# Altium schematic sheet Real_Steel_Robotics.SchDoc
size 420 x 297 mm; SheetNumber: 1; SheetTotal: 1
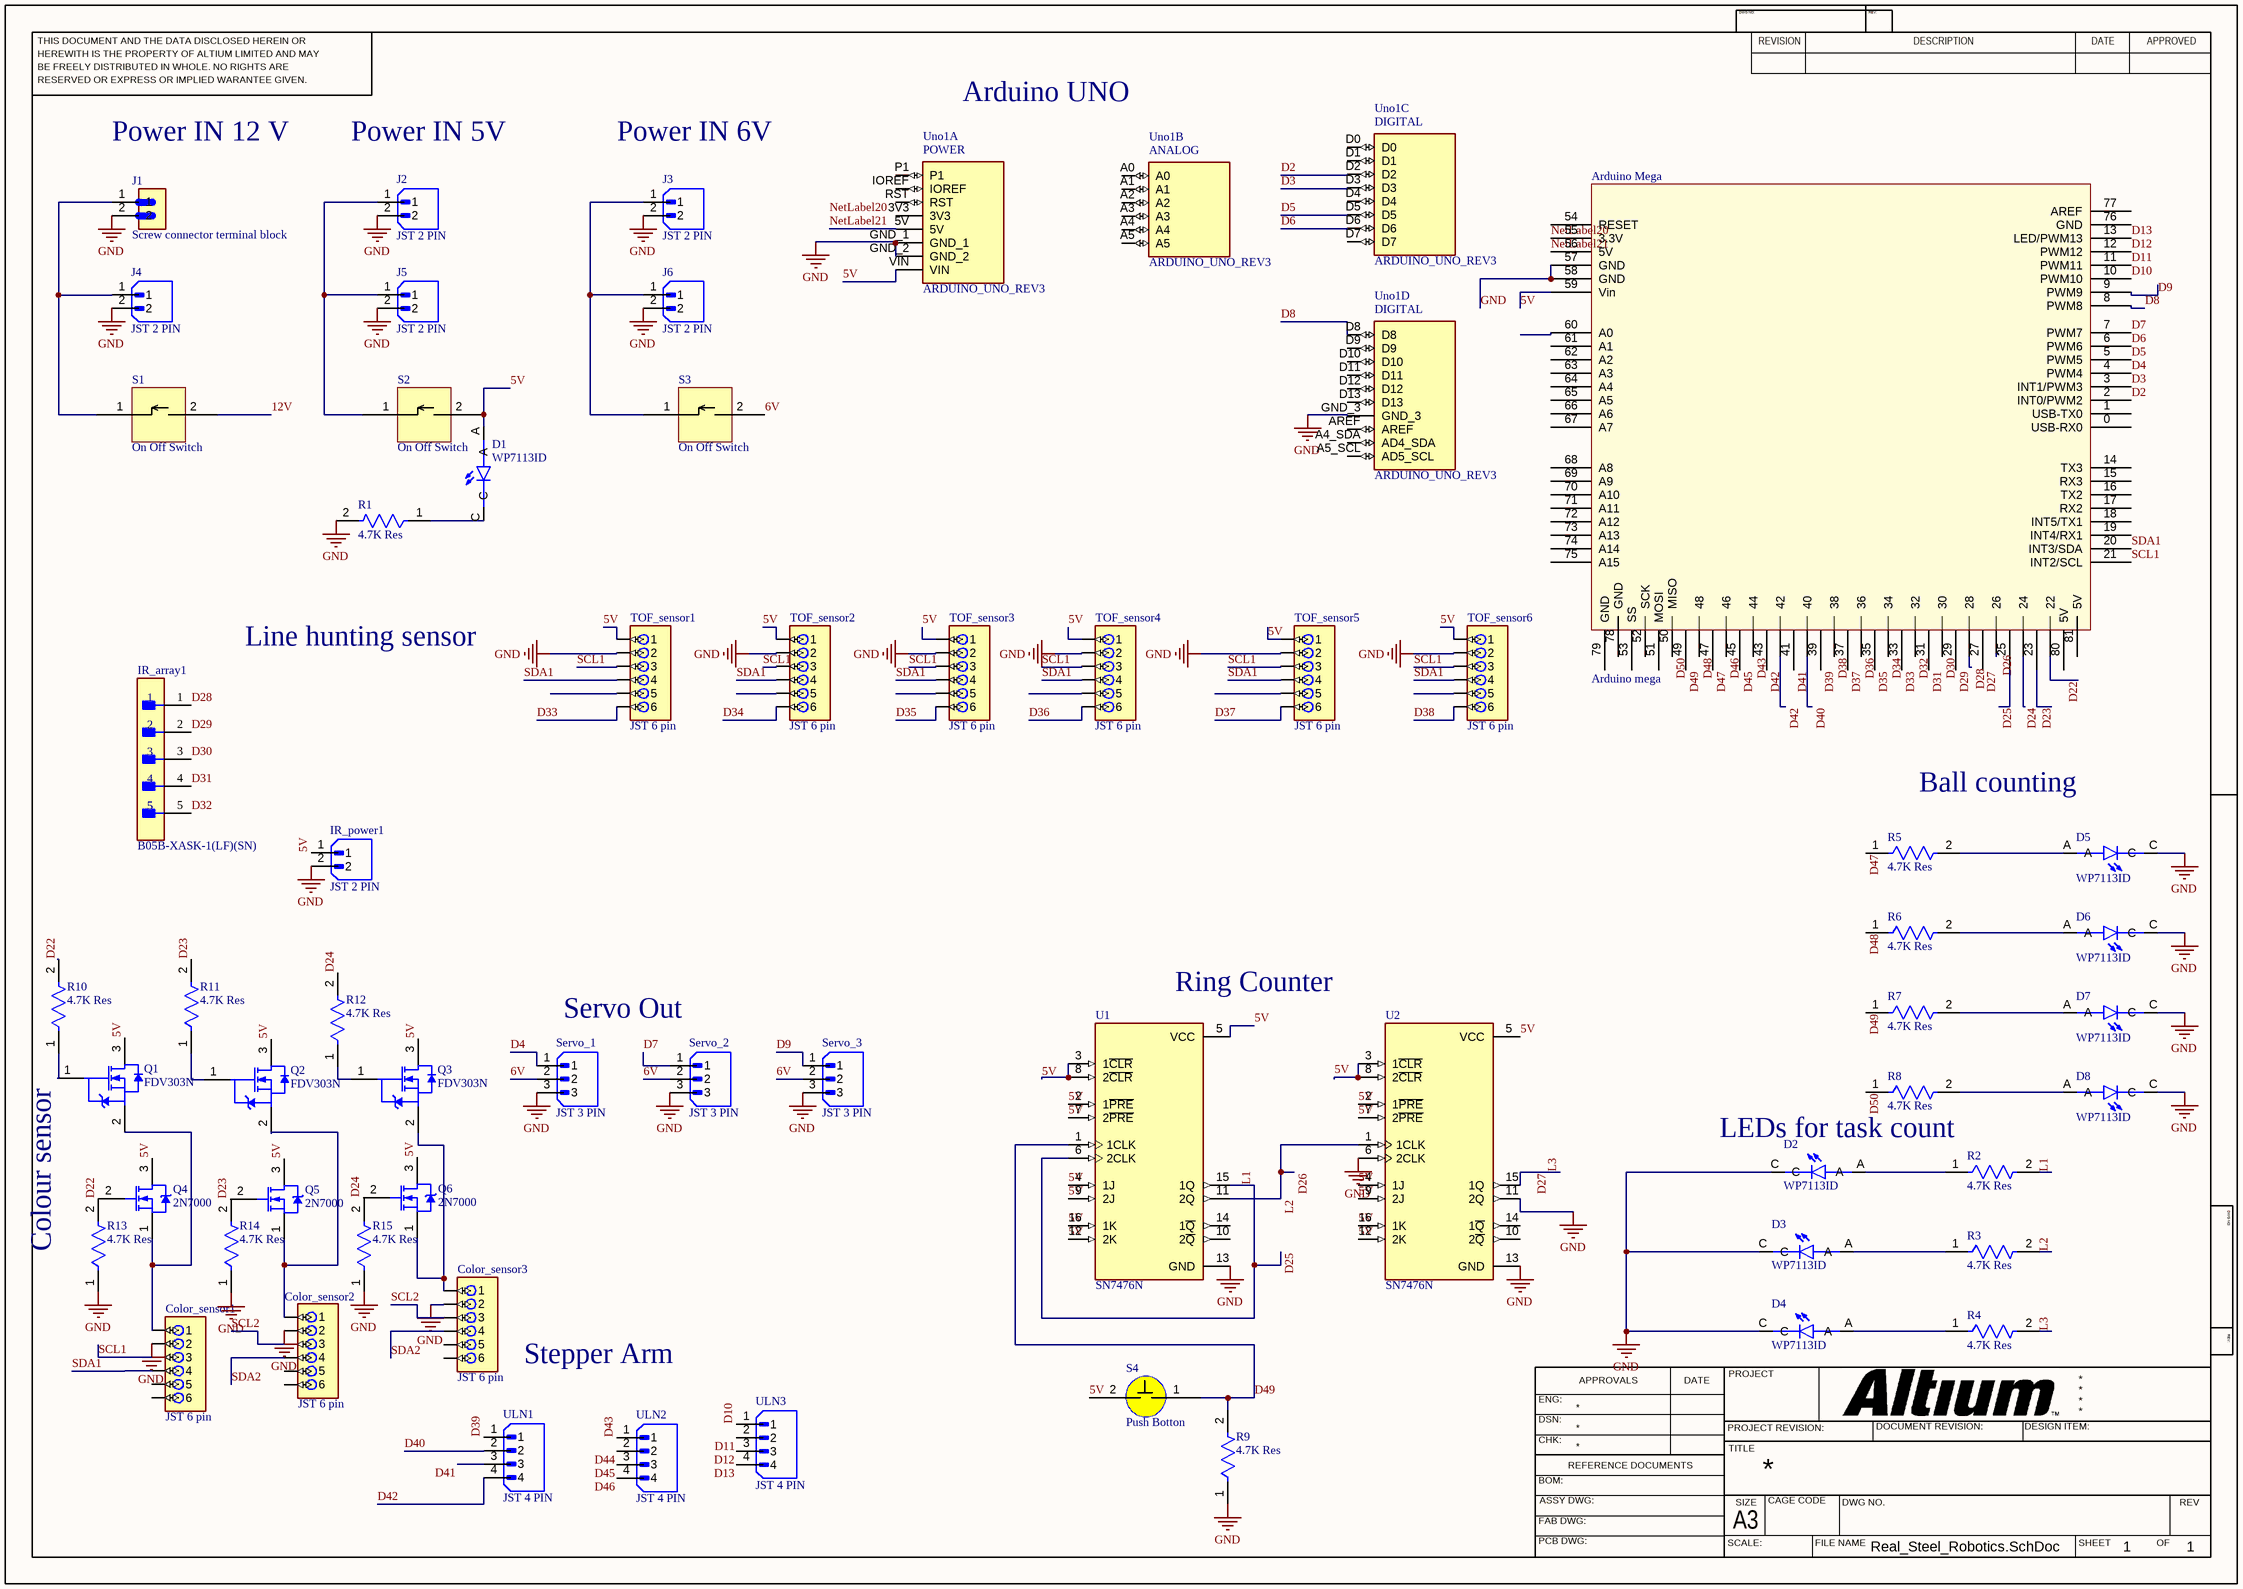
[diagram p0: Real_Steel_Robotics.SchDoc]

## Parts
Arduino_Mega  Arduino mega  [Arduino mega]
Color_sensor1  JST 6 pin  [JST 6 PIN]
Color_sensor2  JST 6 pin  [JST 6 PIN]
Color_sensor3  JST 6 pin  [JST 6 PIN]
D1  WP7113ID  [LED_WP7113ID]
D2  WP7113ID  [LED_WP7113ID]
D3  WP7113ID  [LED_WP7113ID]
D4  WP7113ID  [LED_WP7113ID]
D5  WP7113ID  [LED_WP7113ID]
D6  WP7113ID  [LED_WP7113ID]
D7  WP7113ID  [LED_WP7113ID]
D8  WP7113ID  [LED_WP7113ID]
IR_array1  B05B-XASK-1(LF)(SN)  [JST 5 PIN]
IR_power1  JST 2 PIN  [JST 2 PIN]
J1  Screw connector terminal block  [Screw Connector]
J2  JST 2 PIN  [JST 2 PIN]
J3  JST 2 PIN  [JST 2 PIN]
J4  JST 2 PIN  [JST 2 PIN]
J5  JST 2 PIN  [JST 2 PIN]
J6  JST 2 PIN  [JST 2 PIN]
Q1  FDV303N  [FAIR-FDV303N-3_V]
Q2  FDV303N  [FAIR-FDV303N-3_V]
Q3  FDV303N  [FAIR-FDV303N-3_V]
Q4  2N7000  [ONSC-TO-92-3-29-11]
Q5  2N7000  [ONSC-TO-92-3-29-11]
Q6  2N7000  [ONSC-TO-92-3-29-11]
R1  4.7K Res  [4.7K res]
R2  4.7K Res  [4.7K res]
R3  4.7K Res  [4.7K res]
R4  4.7K Res  [4.7K res]
R5  4.7K Res  [4.7K res]
R6  4.7K Res  [4.7K res]
R7  4.7K Res  [4.7K res]
R8  4.7K Res  [4.7K res]
R9  4.7K Res  [4.7K res]
R10  4.7K Res  [4.7K res]
R11  4.7K Res  [4.7K res]
R12  4.7K Res  [4.7K res]
R13  4.7K Res  [4.7K res]
R14  4.7K Res  [4.7K res]
R15  4.7K Res  [4.7K res]
S1  On Off Switch  [Switch]
S2  On Off Switch  [Switch]
S3  On Off Switch  [Switch]
S4  Push Botton  [Push botton]
Servo_1  JST 3 PIN  [JST 3 PIN]
Servo_2  JST 3 PIN  [JST 3 PIN]
Servo_3  JST 3 PIN  [JST 3 PIN]
TOF_sensor1  JST 6 pin  [JST 6 PIN]
TOF_sensor2  JST 6 pin  [JST 6 PIN]
TOF_sensor3  JST 6 pin  [JST 6 PIN]
TOF_sensor4  JST 6 pin  [JST 6 PIN]
TOF_sensor5  JST 6 pin  [JST 6 PIN]
TOF_sensor6  JST 6 pin  [JST 6 PIN]
U1  SN7476N  [SN7476 IC]
U2  SN7476N  [SN7476 IC]
ULN1  JST 4 PIN  [JST 4 PIN]
ULN2  JST 4 PIN  [JST 4 PIN]
ULN3  JST 4 PIN  [JST 4 PIN]
Uno1  ARDUINO_UNO_REV3  [ARDUINO_ARDUINO_UNO_REV3]  (parts A,B,C,D of 4)

## Nets
GND: Arduino_Mega.57(GND) Arduino_Mega.58(GND) Color_sensor1.2 Color_sensor2.2 Color_sensor3.2 D2.C D3.C D4.C D5.C D6.C D7.C D8.C IR_power1.2 J1.2 J2.2 J3.2 J4.2 J5.2 J6.2 R1.2 R9.1 R14.1 Servo_1.3 Servo_2.3 Servo_3.3 TOF_sensor1.2 TOF_sensor2.2 TOF_sensor3.2 TOF_sensor4.2 TOF_sensor5.2 TOF_sensor6.2 U1.13(GND) U2.6(2CLK) U2.11(2Q) U2.13(GND) Uno1.GND_1 Uno1.GND_2 Uno1.GND_3
5V: Arduino_Mega.59(Vin) D1.A IR_power1.1 Q1.3(D) Q2.3(D) Q3.3(D) Q4.3(D) Q5.3(D) Q6.3(D) S2.2 S4.2(P29) TOF_sensor1.1 TOF_sensor2.1 TOF_sensor3.1 TOF_sensor4.1 TOF_sensor5.1 TOF_sensor6.1 U1.2(1~{PRE}) U1.3(1~{CLR}) U1.4(1J) U1.5(VCC) U1.7(2~{PRE}) U1.8(2~{CLR}) U1.9(2J) U1.12(2K) U1.16(1K) U2.2(1~{PRE}) U2.3(1~{CLR}) U2.4(1J) U2.5(VCC) U2.7(2~{PRE}) U2.8(2~{CLR}) U2.9(2J) U2.12(2K) U2.16(1K) Uno1.VIN
6V: S3.2 Servo_1.2 Servo_2.2 Servo_3.2
12V: S1.2
D2: Arduino_Mega.2(INT0/PWM2) Uno1.D2
D3: Arduino_Mega.3(INT1/PWM3) Uno1.D3
D4: Arduino_Mega.4(PWM4) Servo_1.1
D5: Arduino_Mega.5(PWM5) Uno1.D5
D6: Arduino_Mega.6(PWM6) Uno1.D6
D7: Arduino_Mega.7(PWM7) Servo_2.1
D8: Arduino_Mega.8(PWM8) Uno1.D8
D9: Arduino_Mega.9(PWM9) Servo_3.1
D10: Arduino_Mega.10(PWM10) ULN3.1
D11: Arduino_Mega.11(PWM11) ULN3.2
D12: Arduino_Mega.12(PWM12) ULN3.3
D13: Arduino_Mega.13(LED/PWM13) ULN3.4
D22: Arduino_Mega.22 Q4.2(G) R10.2 R13.2
D23: Arduino_Mega.23 Q5.2(G) R11.2
D24: Arduino_Mega.24 Q6.2(G) R12.2
D25: Arduino_Mega.25 R2.2 U1.6(2CLK) U1.15(1Q)  [also labelled L1]
D26: Arduino_Mega.26 R3.2 U1.11(2Q) U2.1(1CLK)  [also labelled L2]
D27: Arduino_Mega.27 R4.2 U2.15(1Q)  [also labelled L3]
D28: Arduino_Mega.28 IR_array1.1
D29: Arduino_Mega.29 IR_array1.2
D30: Arduino_Mega.30 IR_array1.3
D31: Arduino_Mega.31 IR_array1.4
D32: Arduino_Mega.32 IR_array1.5
D33: Arduino_Mega.33 TOF_sensor1.6
D34: Arduino_Mega.34 TOF_sensor2.6
D35: Arduino_Mega.35 TOF_sensor3.6
D36: Arduino_Mega.36 TOF_sensor4.6
D37: Arduino_Mega.37 TOF_sensor5.6
D38: Arduino_Mega.38 TOF_sensor6.6
D39: Arduino_Mega.39 ULN1.1
D40: Arduino_Mega.40 ULN1.2
D41: Arduino_Mega.41 ULN1.3
D42: Arduino_Mega.42 Arduino_Mega.43 ULN1.4
D43: Arduino_Mega.44 ULN2.1
D44: ULN2.2
D45: Arduino_Mega.45 ULN2.3
D46: Arduino_Mega.46 ULN2.4
D47: Arduino_Mega.47 R5.1
D48: Arduino_Mega.48 R6.1
D49: Arduino_Mega.49 R7.1 R9.2 S4.1(P30) U1.1(1CLK)
D50: Arduino_Mega.50(MISO) R8.1
NetLabel20: Arduino_Mega.55(3.3V)
NetLabel21: Arduino_Mega.56(5V) Uno1.5V
SCL1: Arduino_Mega.21(INT2/SCL) Color_sensor1.3 TOF_sensor1.3 TOF_sensor2.3 TOF_sensor3.3 TOF_sensor4.3 TOF_sensor5.3 TOF_sensor6.3
SCL2: Color_sensor2.3 Color_sensor3.3
SDA1: Arduino_Mega.20(INT3/SDA) Color_sensor1.4 TOF_sensor1.4 TOF_sensor2.4 TOF_sensor3.4 TOF_sensor4.4 TOF_sensor5.4 TOF_sensor6.4
SDA2: Color_sensor2.4 Color_sensor3.4
NetColor_sensor1_1: Color_sensor1.1 Q1.2(S) Q4.1(S)
NetColor_sensor2_1: Color_sensor2.1 Q2.2(S) Q5.1(S)
NetColor_sensor3_1: Color_sensor3.1 Q3.2(S) Q6.1(S)
NetD1_C: D1.C R1.1
NetD2_A: D2.A R2.1
NetD3_A: D3.A R3.1
NetD4_A: D4.A R4.1
NetD5_A: D5.A R5.2
NetD6_A: D6.A R6.2
NetD7_A: D7.A R7.2
NetD8_A: D8.A R8.2
NetJ1_1: J1.1 J4.1 S1.1(P27)
NetJ2_1: J2.1 J5.1 S2.1(P27)
NetJ3_1: J3.1 J6.1 S3.1(P27)
NetQ1_1: Q1.1(G) R10.1
NetQ2_1: Q2.1(G) R11.1
NetQ3_1: Q3.1(G) R12.1

Not connected (* = marked no-connect by the designer): Arduino_Mega 0(USB-RX0) 1(USB-TX0) 14(TX3) 15(RX3) 16(TX2) 17(RX2) 18(INT5/TX1) 19(INT4/RX1) 51(MOSI) 52(SCK) 53(SS) 54(RESET) 60(A0) 61(A1) 62(A2) 63(A3) 64(A4) 65(A5) 66(A6) 67(A7) 68(A8) 69(A9) 70(A10) 71(A11) 72(A12) 73(A13) 74(A14) 75(A15) 76(GND) 77(AREF) 78(GND) 79(GND) 80(5V) 81(5V); Color_sensor1 5 6; Color_sensor2 5 6; Color_sensor3 5 6; R13 1; R14 2; R15 1 2; TOF_sensor1 5; TOF_sensor2 5; TOF_sensor3 5; TOF_sensor4 5; TOF_sensor5 5; TOF_sensor6 5; U1 10(2~{Q}) 14(1~{Q}); U2 10(2~{Q}) 14(1~{Q}); Uno1 3V3 A0 A1 A2 A3 A4 A4_SDA(AD4_SDA) A5 A5_SCL(AD5_SCL) AREF D0 D1 D4 D7 D9 D10 D11 D12 D13 IOREF P1 RST

## Notes on the sheet
- Arduino UNO
- (near J1) Power IN 12 V
- (near J2) Power IN 5V
- (near J3) Power IN 6V
- Line hunting sensor
- Ball counting
- Ring Counter
- Servo Out
- LEDs for task count
- Colour sensor
- Stepper Arm
- Labels drawn without touching a wire or pin: GND, NetLabel20
- THIS DOCUMENT AND THE DATA DISCLOSED HEREIN OR
- HEREWITH IS THE PROPERTY OF ALTIUM LIMITED AND MAY
- DWG NO:
- REVISION
- REV:
- DESCRIPTION
- DATE
- APPROVED
- BE FREELY DISTRIBUTED IN WHOLE. NO RIGHTS ARE
- RESERVED OR EXPRESS OR IMPLIED WARANTEE GIVEN.
- ENG:
- APPROVALS
- PROJECT
- DSN:
- CHK:
- REFERENCE DOCUMENTS
- PROJECT REVISION:
- TITLE
- DOCUMENT REVISION:
- DESIGN ITEM:
- BOM:
- FAB DWG:
- PCB DWG:
- ASSY DWG:
- SCALE:
- A3
- SIZE
- CAGE CODE
- FILE NAME
- DWG NO.
- SHEET
- OF
- REV
- (in symbol ARDUINO_UNO_REV3, part A) POWER
- (in symbol ARDUINO_UNO_REV3, part B) ANALOG
- (in symbol ARDUINO_UNO_REV3, part C) DIGITAL
- (in symbol ARDUINO_UNO_REV3, part D) DIGITAL

## Library data of the parts
Color_sensor1-Color_sensor3 TOF_sensor1-TOF_sensor6 = JST 6 pin: Header B6B-ZR, 1.50mm, 6-contacts, top entry, THT, /2000/box; Supplier: Digikey; Supplier Part Number: 455-B6B-ZR-ND; Manufacturer: JST; Manufacturer Part Number: B6B-ZR; RoHS: Yes; Category: Board to Board Connectors; Stock: 39862; Pricing: 1=0.2, 10=0.168, 100=0.143, 500=0.12762, 2000=0.11571, 6000=0.10707, 10000=0.10328 (USD); ComponentLink1URL: https://datasheet.ciiva.com/6905/zhconnector-6905949.pdf?src-supplier=Digikey; ComponentLink1Description: https://datasheet.ciiva.com/6905/zhconnector-6905949.pdf?src-supplier=Digikey
D1-D8 = WP7113ID: Red 617nm LED Indication - Discrete 2V Radial; MF: Kingbright; Price: None; MP: WP7113ID; Package: Radial Kingbright; Check_prices: https://www.snapeda.com/parts/WP7113ID/Kingbright/view-part/?ref=eda; Purchase-URL: https://pricing.snapeda.com/search/part/WP7113ID/?ref=eda; Availability: In Stock; Value: *; SnapEDA_Link: https://www.snapeda.com/parts/WP7113ID/Kingbright/view-part/?ref=snap
IR_array1 = JST 5 PIN: CONN HEADER VERT 5POS 2.5MM; Current Rating: 3A; Number of Positions: 5; Voltage Rating: 250V; Lead Length: 3.4mm; Wire/Cable Gauge: 20AWG; Insulation Resistance: 1GR; Gender: Male; Mated Stacking Heights: 11.3mm; Contact Resistance: 10mR; Flammability Rating: UL94 V-0; Max Operating Temperature: 85°C; Number of Rows: 1; Contact Shape: Circular; Pitch: 2.5mm; Orientation: Straight; Color: Beige; Termination: Solder; Number of Pins: 5; Packaging: Bulk; Length: 15mm; Height: 8.8mm; Number of Contacts: 5; Insulation Material: Nylon; Fastening Type: Ramp; Contact Plating: Tin; Connector Type: Header; Voltage Rating (AC): 250V; Mount: Through Hole; Contact Finish - Mating: TIN; Number of Poles: 5; Material: Nylon; Contact Material: Copper Alloy; Insulation Color: Natural; Lead Free: Lead Free; Contact Type: Male Pin; REACH SVHC: No SVHC; Series: XA; Voltage Rating (DC): 250V; Width: 6.4mm; Min Operating Temperature: -25°C
IR_power1 J2-J6 = JST 2 PIN: Connector Header Through Hole 2 position 0.098 (2.50mm); MF: JST Sales; MP: B2B-XH-A (LF)(SN); SnapEDA_Link: https://www.snapeda.com/parts/B2B-XH-A%20(LF)(SN)/JST+Sales+America+Inc./view-part/?ref=snap; Package: None; Value: *; Check_prices: https://www.snapeda.com/parts/B2B-XH-A%20(LF)(SN)/JST+Sales+America+Inc./view-part/?ref=eda
Q1-Q3 = CMP-2000-05111-1: N-Channel MOSFET Transistor, 8 V VGSS, 25 V VDSS, 0.68 A, -55 to 150 degC, 3-Pin SOT23, RoHS, Tape and Reel; Manufacturer: Fairchild; Typical Turn-On Delay Time: 3ns; Channel Mode: Enhancement; RDS-on: 450@4.5VmOhm; Maximum Continuous Drain Current: 0.68A; Maximum Drain Source Voltage: 25V; Rad Hard: No; Typical Fall Time: 13ns; Channel Type: N; Typical Turn-Off Delay Time: 17ns; Maximum Gate Source Voltage: 8V; Typical Rise Time: 8.5ns; Mounting: SurfaceMount; Packaging: Tape&Reel; Manufacturer URL: https://www.fairchildsemi.com/; Datasheet URL: https://datasheet.ciiva.com/22681/1845307-22681736.pdf; Package: 3SOT-23; Category: MOSFET; Operating Temperature: -55to150degC; Datasheet Version: Rev. D2, 07/2014
Q4-Q6 = CMP-1058-00936-1: Small Signal MOSFET, 200 mA, 60 V, N-Channel, 3-Pin TO-92, Bulk Box; Manufacturer: On Semiconductor; Ciss Typ (pF): 60; VGS(th) Max (V): 3; Crss Typ (pF): 5; Channel Polarity: N Channel; VGS Max (V): 20; Configuration: Single; PD Max (W): 0.35; Coss Typ (pF): 25; ID Max (A): 0.2; PackageVersion: Rev. AM; ComponentLink3URL: http://www.onsemi.cn/pub_link/Collateral/2N6426-D.PDF; ComponentLink2URL: http://www.onsemi.com/pub_link/Collateral/2N7000-D.PDF; DatasheetVersion: Rev. 8; Mounting Technology: Through Hole; V(BR)DSS Min (V): 60; PartNumber: 2N7000; PackageDescription: 3-Pin Transistor Outline, Body 4.825 x 3.685 mm, Pitch 1.27 mm; ComponentLink2Description: Datasheet; ComponentLink1URL: http://www.onsemi.com/; PackageReference: TO-92-3-29-11_AM_SL; Packing: Bulk Box; ComponentLink1Description: Manufacturer URL; Package Type: TO-92; ComponentLink3Description: Package Specification
U1 U2 = SN7476N: Flip Flops Dual J-K Positive-Edge-Triggered Flip-Flops with Preset and Clear 16-PDIP 0 to 70; MF: Texas Instruments; SnapEDA_Link: https://www.snapeda.com/parts/SN7476N/Texas+Instruments/view-part/?ref=snap; Package: PDIP-16 Texas Instruments; Value: *; MP: SN7476N; Check_prices: https://www.snapeda.com/parts/SN7476N/Texas+Instruments/view-part/?ref=eda
Uno1 = ARDUINO_UNO_REV3: Microcontroller board based on the ATmega328P.; MP: ARDUINO UNO REV3; SnapEDA_Link: https://www.snapeda.com/parts/ARDUINO%20UNO%20REV3/Arduino/view-part/?ref=snap; Package: Non-Standard Arduino; Value: *; MF: Arduino; Check_prices: https://www.snapeda.com/parts/ARDUINO%20UNO%20REV3/Arduino/view-part/?ref=eda